# EAGLE design SSD1963-V1.0 (EAGLE 9.6.1)

## Sheet 1 of 2
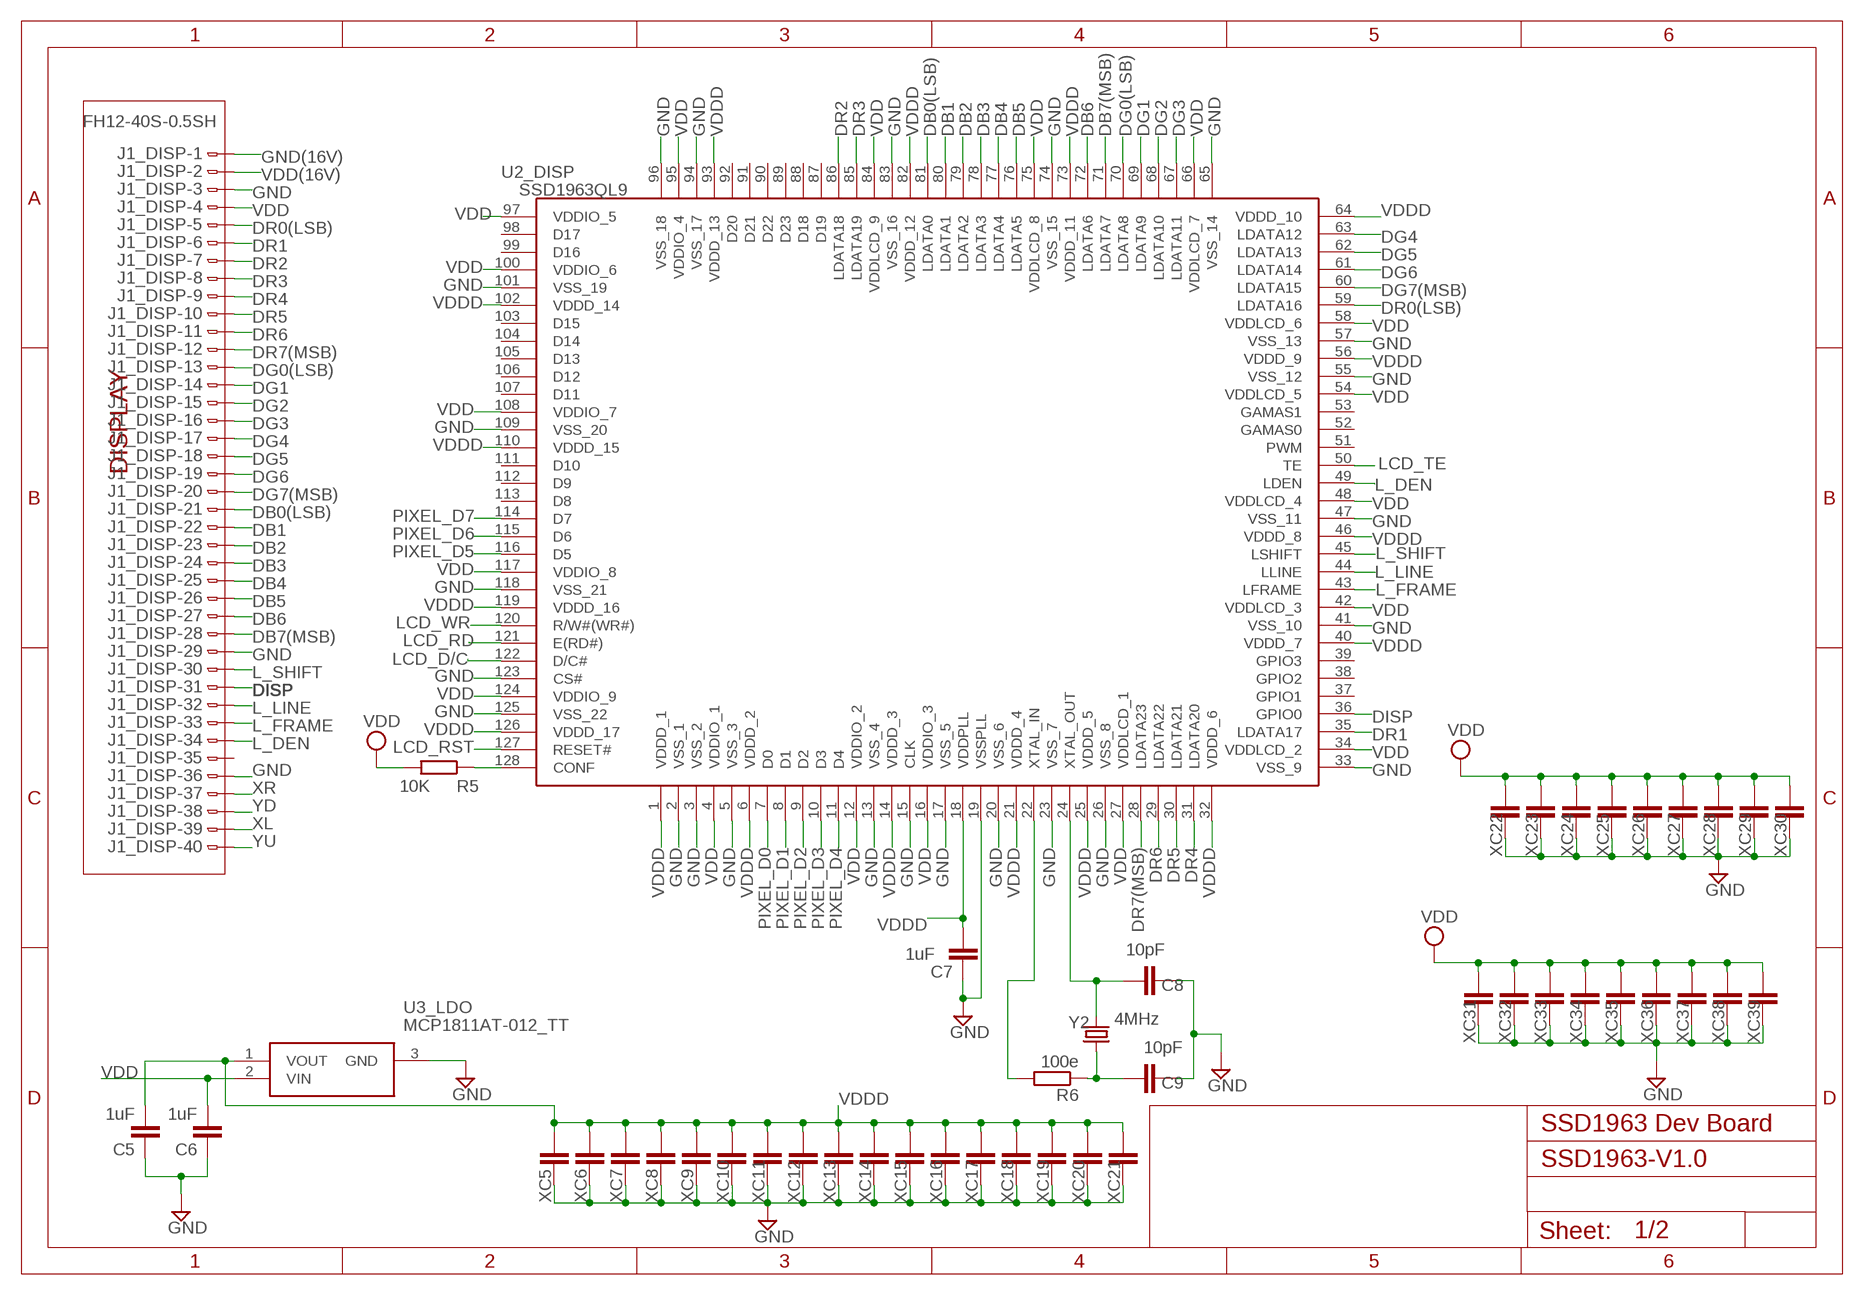
[diagram p0: schematic, sheet 1]

### Parts
C5  1uF  C-EUC1206  [C1206]
C6  1uF  C-EUC1206  [C1206]
C7  1uF  C-EUC0805  [C0805]
C8  10pF  C-EUC1206  [C1206]
C9  10pF  C-EUC1206  [C1206]
J1_DISP  FH12-40S-0.5SH  [FH12-40S-0.5SH]
R5  10K  R-EU_R1206  [R1206]
R6  100e  R-EU_R0805  [R0805]
U2_DISP  SSD1963QL9  [QFP40P1600X1600X160-128N]
U3_LDO  MCP1811AT-012_TT  [SOT95P237X112-3N]
XC5  0.1uF  C-EUC0805  [C0805]
XC6  0.1uF  C-EUC0805  [C0805]
XC7  0.1uF  C-EUC0805  [C0805]
XC8  0.1uF  C-EUC0805  [C0805]
XC9  0.1uF  C-EUC0805  [C0805]
XC10  0.1uF  C-EUC0805  [C0805]
XC11  0.1uF  C-EUC0805  [C0805]
XC12  0.1uF  C-EUC0805  [C0805]
XC13  0.1uF  C-EUC0805  [C0805]
XC14  0.1uF  C-EUC0805  [C0805]
XC15  0.1uF  C-EUC0805  [C0805]
XC16  0.1uF  C-EUC0805  [C0805]
XC17  0.1uF  C-EUC0805  [C0805]
XC18  0.1uF  C-EUC0805  [C0805]
XC19  0.1uF  C-EUC0805  [C0805]
XC20  0.1uF  C-EUC0805  [C0805]
XC21  0.1uF  C-EUC0805  [C0805]
XC22  0.1uF  C-EUC0805  [C0805]
XC23  0.1uF  C-EUC0805  [C0805]
XC24  0.1uF  C-EUC0805  [C0805]
XC25  0.1uF  C-EUC0805  [C0805]
XC26  0.1uF  C-EUC0805  [C0805]
XC27  0.1uF  C-EUC0805  [C0805]
XC28  0.1uF  C-EUC0805  [C0805]
XC29  0.1uF  C-EUC0805  [C0805]
XC30  0.1uF  C-EUC0805  [C0805]
XC31  0.1uF  C-EUC0805  [C0805]
XC32  0.1uF  C-EUC0805  [C0805]
XC33  0.1uF  C-EUC0805  [C0805]
XC34  0.1uF  C-EUC0805  [C0805]
XC35  0.1uF  C-EUC0805  [C0805]
XC36  0.1uF  C-EUC0805  [C0805]
XC37  0.1uF  C-EUC0805  [C0805]
XC38  0.1uF  C-EUC0805  [C0805]
XC39  0.1uF  C-EUC0805  [C0805]
Y2  4MHz  CRYSTALHC49UP  [HC49UP]

### Nets
DB0(LSB): J1_DISP.20 U2_DISP.81(LDATA0)
DB1: J1_DISP.19 U2_DISP.80(LDATA1)
DB2: J1_DISP.18 U2_DISP.79(LDATA2)
DB3: J1_DISP.17 U2_DISP.78(LDATA3)
DB4: J1_DISP.16 U2_DISP.77(LDATA4)
DB5: J1_DISP.15 U2_DISP.76(LDATA5)
DB6: J1_DISP.14 U2_DISP.72(LDATA6)
DB7(MSB): J1_DISP.13 U2_DISP.71(LDATA7)
DG0(LSB): J1_DISP.28 U2_DISP.70(LDATA8)
DG1: J1_DISP.27 U2_DISP.69(LDATA9)
DG2: J1_DISP.26 U2_DISP.68(LDATA10)
DG3: J1_DISP.25 U2_DISP.67(LDATA11)
DG4: J1_DISP.24 U2_DISP.63(LDATA12)
DG5: J1_DISP.23 U2_DISP.62(LDATA13)
DG6: J1_DISP.22 U2_DISP.61(LDATA14)
DG7(MSB): J1_DISP.21 U2_DISP.60(LDATA15)
DISP: J1_DISP.10 U2_DISP.36(GPIO0)
DR0(LSB): J1_DISP.36 U2_DISP.59(LDATA16)
DR1: J1_DISP.35 U2_DISP.35(LDATA17)
DR2: J1_DISP.34 U2_DISP.86(LDATA18)
DR3: J1_DISP.33 U2_DISP.85(LDATA19)
DR4: J1_DISP.32 U2_DISP.31(LDATA20)
DR5: J1_DISP.31 U2_DISP.30(LDATA21)
DR6: J1_DISP.30 U2_DISP.29(LDATA22)
DR7(MSB): J1_DISP.29 U2_DISP.28(LDATA23)
GND: C5.1 C6.1 C7.1 C8.1 C9.1 J1_DISP.5 J1_DISP.12 J1_DISP.38 U2_DISP.2(VSS_1) U2_DISP.3(VSS_2) U2_DISP.5(VSS_3) U2_DISP.13(VSS_4) U2_DISP.15(CLK) U2_DISP.17(VSS_5) U2_DISP.19(VSSPLL) U2_DISP.20(VSS_6) U2_DISP.23(VSS_7) U2_DISP.26(VSS_8) U2_DISP.33(VSS_9) U2_DISP.41(VSS_10) U2_DISP.47(VSS_11) U2_DISP.55(VSS_12) U2_DISP.57(VSS_13) U2_DISP.65(VSS_14) U2_DISP.74(VSS_15) U2_DISP.83(VSS_16) U2_DISP.94(VSS_17) U2_DISP.96(VSS_18) U2_DISP.101(VSS_19) U2_DISP.109(VSS_20) U2_DISP.118(VSS_21) U2_DISP.123(CS#) U2_DISP.125(VSS_22) U3_LDO.3(GND) XC5.1 XC6.1 XC7.1 XC8.1 XC9.1 XC10.1 XC11.1 XC12.1 XC13.1 XC14.1 XC15.1 XC16.1 XC17.1 XC18.1 XC19.1 XC20.1 XC21.1 XC22.1 XC23.1 XC24.1 XC25.1 XC26.1 XC27.1 XC28.1 XC29.1 XC30.1 XC31.1 XC32.1 XC33.1 XC34.1 XC35.1 XC36.1 XC37.1 XC38.1 XC39.1 ; also sheet 2
GND(16V): J1_DISP.40 ; also sheet 2
L_DEN: J1_DISP.7 U2_DISP.49(LDEN)
L_FRAME: J1_DISP.8 U2_DISP.43(LFRAME)
L_LINE: J1_DISP.9 U2_DISP.44(LLINE)
L_SHIFT: J1_DISP.11 U2_DISP.45(LSHIFT)
LCD_D/C: U2_DISP.122(D/C#) ; also sheet 2
LCD_RD: U2_DISP.121(E(RD#)) ; also sheet 2
LCD_RST: U2_DISP.127(RESET#) ; also sheet 2
LCD_TE: U2_DISP.50(TE) ; also sheet 2
LCD_WR: U2_DISP.120(R/W#(WR#)) ; also sheet 2
N$4: R5.1 U2_DISP.128(CONF)
N$54: C8.2 U2_DISP.24(XTAL_OUT) Y2.2
N$55: C9.2 R6.1 Y2.1
N$60: R6.2 U2_DISP.22(XTAL_IN)
PIXEL_D0: U2_DISP.7(D0) ; also sheet 2
PIXEL_D1: U2_DISP.8(D1) ; also sheet 2
PIXEL_D2: U2_DISP.9(D2) ; also sheet 2
PIXEL_D3: U2_DISP.10(D3) ; also sheet 2
PIXEL_D4: U2_DISP.11(D4) ; also sheet 2
PIXEL_D5: U2_DISP.116(D5) ; also sheet 2
PIXEL_D6: U2_DISP.115(D6) ; also sheet 2
PIXEL_D7: U2_DISP.114(D7) ; also sheet 2
VDD: C6.2 J1_DISP.37 R5.2 U2_DISP.4(VDDIO_1) U2_DISP.12(VDDIO_2) U2_DISP.16(VDDIO_3) U2_DISP.27(VDDLCD_1) U2_DISP.34(VDDLCD_2) U2_DISP.42(VDDLCD_3) U2_DISP.48(VDDLCD_4) U2_DISP.54(VDDLCD_5) U2_DISP.58(VDDLCD_6) U2_DISP.66(VDDLCD_7) U2_DISP.75(VDDLCD_8) U2_DISP.84(VDDLCD_9) U2_DISP.95(VDDIO_4) U2_DISP.97(VDDIO_5) U2_DISP.100(VDDIO_6) U2_DISP.108(VDDIO_7) U2_DISP.117(VDDIO_8) U2_DISP.124(VDDIO_9) U3_LDO.2(VIN) XC22.2 XC23.2 XC24.2 XC25.2 XC26.2 XC27.2 XC28.2 XC29.2 XC30.2 XC31.2 XC32.2 XC33.2 XC34.2 XC35.2 XC36.2 XC37.2 XC38.2 XC39.2 ; also sheet 2
VDD(16V): J1_DISP.39 ; also sheet 2
VDDD: C5.2 C7.2 U2_DISP.1(VDDD_1) U2_DISP.6(VDDD_2) U2_DISP.14(VDDD_3) U2_DISP.18(VDDPLL) U2_DISP.21(VDDD_4) U2_DISP.25(VDDD_5) U2_DISP.32(VDDD_6) U2_DISP.40(VDDD_7) U2_DISP.46(VDDD_8) U2_DISP.56(VDDD_9) U2_DISP.64(VDDD_10) U2_DISP.73(VDDD_11) U2_DISP.82(VDDD_12) U2_DISP.93(VDDD_13) U2_DISP.102(VDDD_14) U2_DISP.110(VDDD_15) U2_DISP.119(VDDD_16) U2_DISP.126(VDDD_17) U3_LDO.1(VOUT) XC5.2 XC6.2 XC7.2 XC8.2 XC9.2 XC10.2 XC11.2 XC12.2 XC13.2 XC14.2 XC15.2 XC16.2 XC17.2 XC18.2 XC19.2 XC20.2 XC21.2
XL: J1_DISP.2 ; also sheet 2
XR: J1_DISP.4 ; also sheet 2
YD: J1_DISP.3 ; also sheet 2
YU: J1_DISP.1 ; also sheet 2
Unconnected: J1_DISP.6 U2_DISP.37(GPIO1) U2_DISP.38(GPIO2) U2_DISP.39(GPIO3) U2_DISP.51(PWM) U2_DISP.52(GAMAS0) U2_DISP.53(GAMAS1) U2_DISP.87(D19) U2_DISP.88(D18) U2_DISP.89(D23) U2_DISP.90(D22) U2_DISP.91(D21) U2_DISP.92(D20) U2_DISP.98(D17) U2_DISP.99(D16) U2_DISP.103(D15) U2_DISP.104(D14) U2_DISP.105(D13) U2_DISP.106(D12) U2_DISP.107(D11) U2_DISP.111(D10) U2_DISP.112(D9) U2_DISP.113(D8)

### Notes on the sheet
- DISPLAY
- SSD1963 Dev Board

## Sheet 2 of 2
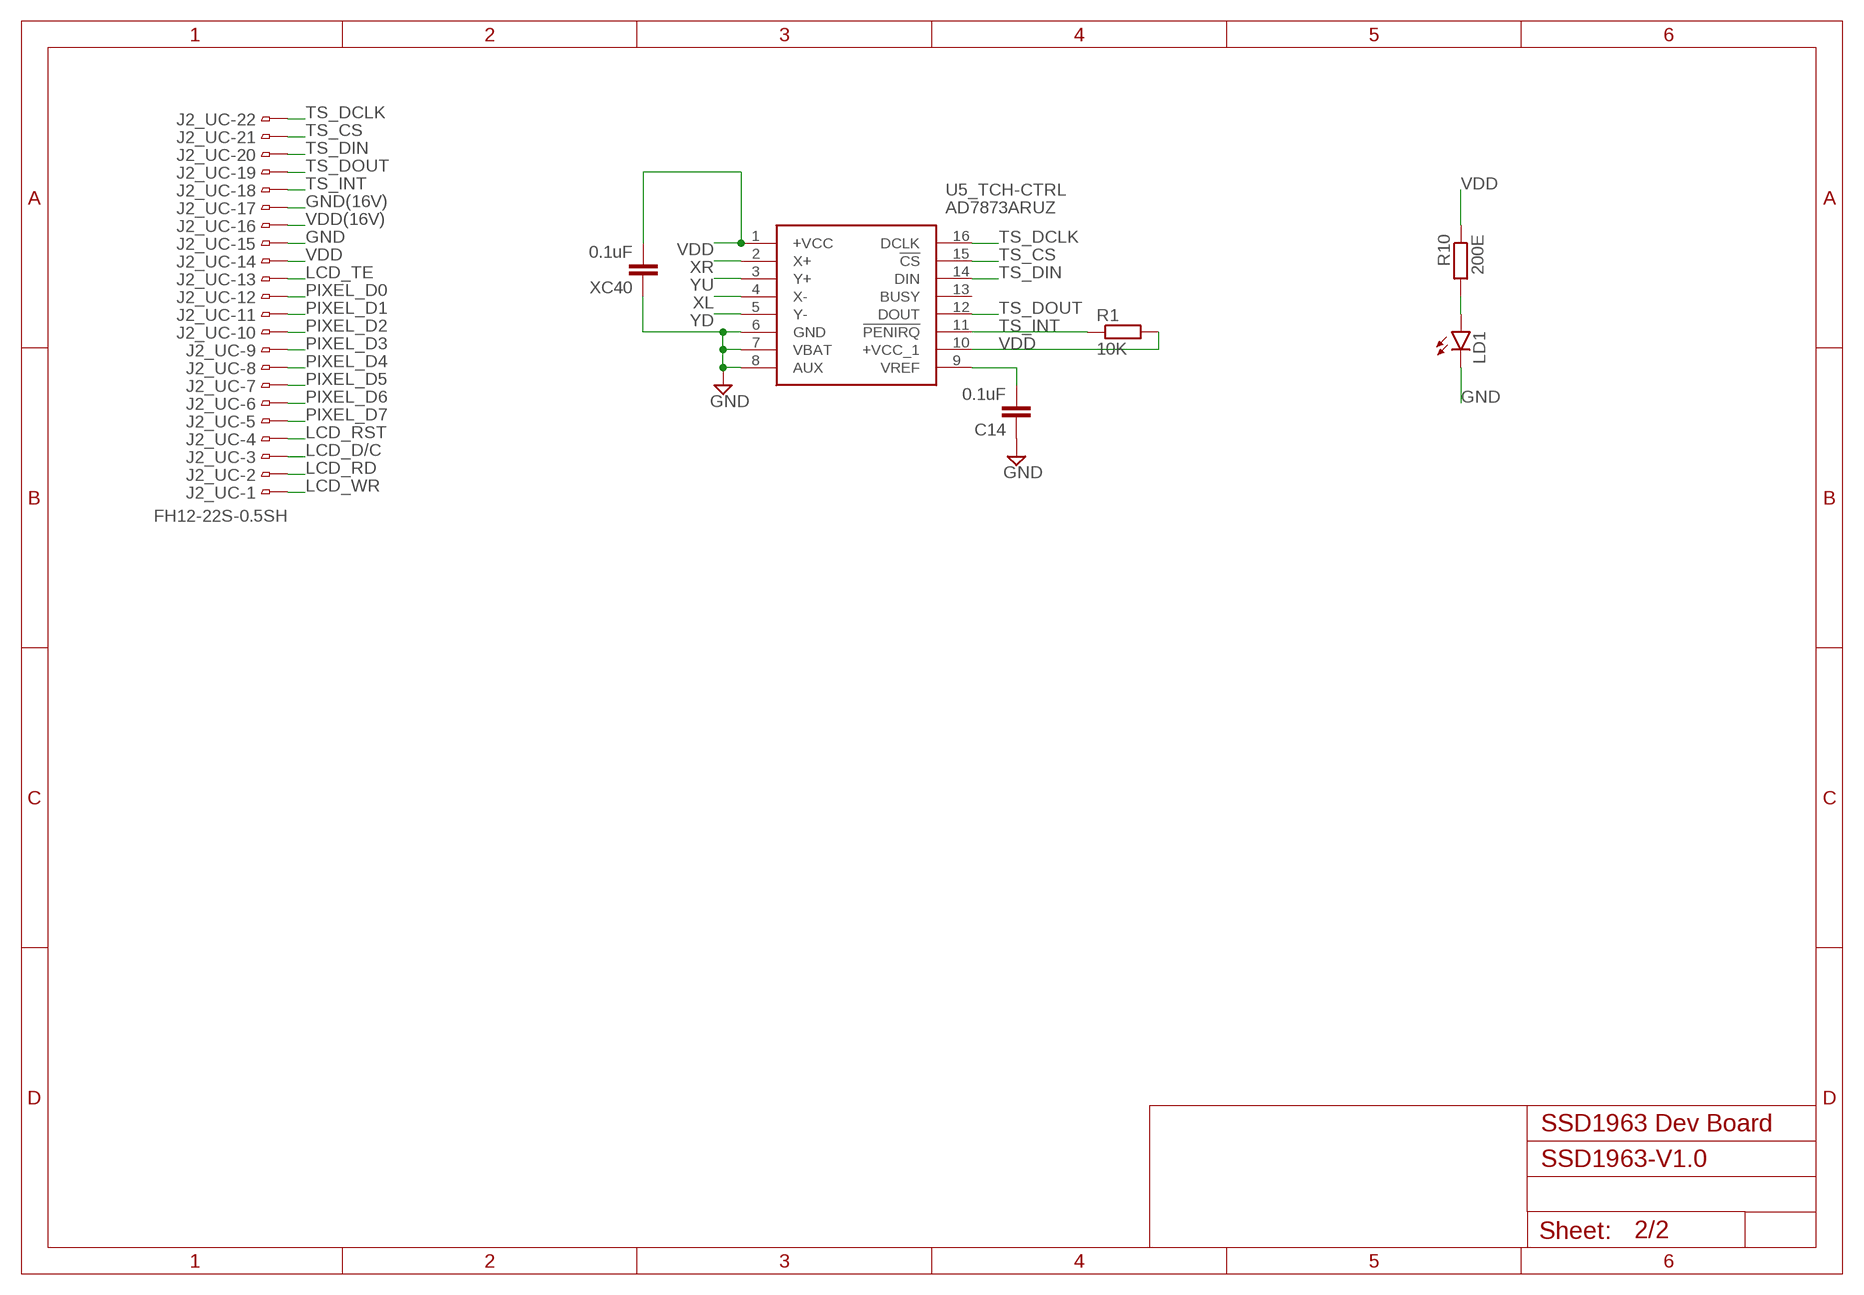
[diagram p1: schematic, sheet 2]

### Parts
C14  0.1uF  C-EUC1206  [C1206]
J2_UC  FH12-22S-0.5SH  [FH12-22S-0.5SH]
LD1  LEDCHIPLED_1206  [CHIPLED_1206]
R1  10K  R-EU_R1206  [R1206]
R10  200E  R-EU_R1206  [R1206]
U5_TCH-CTRL  AD7873ARUZ  [SOP64P600X175-16N]
XC40  0.1uF  C-EUC0805  [C0805]

### Nets
GND: C14.1 J2_UC.15 LD1.C U5_TCH-CTRL.6(GND) U5_TCH-CTRL.7(VBAT) U5_TCH-CTRL.8(AUX) XC40.1 ; also sheet 1
GND(16V): J2_UC.17 ; also sheet 1
LCD_D/C: J2_UC.3 ; also sheet 1
LCD_RD: J2_UC.2 ; also sheet 1
LCD_RST: J2_UC.4 ; also sheet 1
LCD_TE: J2_UC.13 ; also sheet 1
LCD_WR: J2_UC.1 ; also sheet 1
N$9: C14.2 U5_TCH-CTRL.9(VREF)
N$14: LD1.A R10.2
PIXEL_D0: J2_UC.12 ; also sheet 1
PIXEL_D1: J2_UC.11 ; also sheet 1
PIXEL_D2: J2_UC.10 ; also sheet 1
PIXEL_D3: J2_UC.9 ; also sheet 1
PIXEL_D4: J2_UC.8 ; also sheet 1
PIXEL_D5: J2_UC.7 ; also sheet 1
PIXEL_D6: J2_UC.6 ; also sheet 1
PIXEL_D7: J2_UC.5 ; also sheet 1
TS_CS: J2_UC.21 U5_TCH-CTRL.15(!CS)
TS_DCLK: J2_UC.22 U5_TCH-CTRL.16(DCLK)
TS_DIN: J2_UC.20 U5_TCH-CTRL.14(DIN)
TS_DOUT: J2_UC.19 U5_TCH-CTRL.12(DOUT)
TS_INT: J2_UC.18 R1.1 U5_TCH-CTRL.11(!PENIRQ)
VDD: J2_UC.14 R1.2 R10.1 U5_TCH-CTRL.1(+VCC) U5_TCH-CTRL.10(+VCC_1) XC40.2 ; also sheet 1
VDD(16V): J2_UC.16 ; also sheet 1
XL: U5_TCH-CTRL.4(X-) ; also sheet 1
XR: U5_TCH-CTRL.2(X+) ; also sheet 1
YD: U5_TCH-CTRL.5(Y-) ; also sheet 1
YU: U5_TCH-CTRL.3(Y+) ; also sheet 1
Unconnected: U5_TCH-CTRL.13(BUSY)

### Notes on the sheet
- SSD1963 Dev Board

## Library data of the parts
C5-C9 C14 XC5-XC40 = rcl:C-EU: CAPACITOR, European symbol; DESCRIPTION: Capacitor; SPICEPREFIX: C
J1_DISP = ETTCC:FH12-40S-0.5S: 0.5mm Pitch Connectors For FPC/FFC Source: Data sheet <http://www.hirose.co.jp/cataloge_hp/e58605370.pdf>; DESCRIPTION: 0.5mm Pitch Connectors For FPC/FFC; MPN: FH12-40S-0.5SH(55); OC_FARNELL: 1324556; OC_NEWARK: 34M6178
J2_UC = con-hirose:FH12-22S-0.5S: 0.5mm Pitch Connectors For FPC/FFC Source: Data sheet <http://www.hirose.co.jp/cataloge_hp/e58605370.pdf>; OC_FARNELL: 1324551; OC_NEWARK: unknown
LD1 = led:LED: LED OSRAM: - CHIPLED LG R971, LG N971, LY N971, LG Q971, LY Q971, LO R971, LY R971 LH N974, LH R974 LS Q976, LO Q976, LY Q976 LO Q996 - Hyper CHIPLED LW Q18S LB Q993, LB Q99A, LB R99A - SideLED LS A670, LO A670, LY A670, LG A670, LP A670 LB A673, LV A673, LT A673, LW A673 LH A674 LY A675 LS A676, LA A676, LO A676, LY A676, LW A676 LS A679, LY A679, LG A679 - Hyper Micro SIDELED® LS Y876, LA Y876, LO Y876, LY Y876 LT Y87S - SmartLED LW L88C, LW L88S LB L89C, LB L89S, LG L890 LS L89K, LO L89K, LY L89K LS L896, LA L896, LO L896, LY L896 - TOPLED LS T670, LO T670, LY T670, LG T670, LP T670 LSG T670, LSP T670, LSY T670, LOP T670, LYG T670 LG T671, LOG T671, LSG T671 LB T673, LV T673, LT T673, LW T673 LH T674 LS T676, LA T676, LO T676, LY T676, LB T676, LH T676, LSB T676, LW T676 LB T67C, LV T67C, LT T67C, LS T67K, LO T67K, LY T67K, LW E67C LS E67B, LA E67B, LO E67B, LY E67B, LB E67C, LV E67C, LT E67C LW T67C LS T679, LY T679, LG T679 LS T770, LO T770, LY T770, LG T770, LP T770 LB T773, LV T773, LT T773, LW T773 LH T774 LS E675, LA E675, LY E675, LS T675 LS T776, LA T776, LO T776, LY T776, LB T776 LHGB T686 LT T68C, LB T68C - Hyper Mini TOPLED® LB M676 - Mini TOPLED Santana® LG M470 LS M47K, LO M47K, LY M47K Source: http://www.osram.convergy.de LUXEON: - LUMILED® LXK2-PW12-R00, LXK2-PW12-S00, LXK2-PW14-U00, LXK2-PW14-V00 LXK2-PM12-R00, LXK2-PM12-S00, LXK2-PM14-U00 LXK2-PE12-Q00, LXK2-PE12-R00, LXK2-PE12-S00, LXK2-PE14-T00, LXK2-PE14-U00 LXK2-PB12-K00, LXK2-PB12-L00, LXK2-PB12-M00, LXK2-PB14-N00, LXK2-PB14-P00, LXK2-PB14-Q00 LXK2-PR12-L00, LXK2-PR12-M00, LXK2-PR14-Q00, LXK2-PR14-R00 LXK2-PD12-Q00, LXK2-PD12-R00, LXK2-PD12-S00 LXK2-PH12-R00, LXK2-PH12-S00 LXK2-PL12-P00, LXK2-PL12-Q00, LXK2-PL12-R00 Source: www.luxeon.com KINGBRIGHT: KA-3528ASYC Source: www.kingbright.com; DESCRIPTION: SMD Green LED
R1 = rcl:R-EU_: RESISTOR, European symbol; SPICEPREFIX: R
R5 R6 R10 = rcl:R-EU_: RESISTOR, European symbol; DESCRIPTION: Resistor; SPICEPREFIX: R
U2_DISP = ETTCC:SSD1963QL9: 1215KB Embedded Display SRAM LCD Display Controller, LQFP-128 Source: Datasheet <https://www.allshore.com/pdf/solomon_systech_ssd1963.pdf>; DESCRIPTION: 1215KB Embedded Display SRAM LCD Display Controller, LQFP-128
U3_LDO = ETTCC:MCP1811AT-012_TT: LDO Voltage Regulators 1.2V 3-Lead SOT-23 150mA Ultra Low Iq LDO with Auto-Discharge Source: Datasheet <https://datasheet.datasheetarchive.com/originals/dk/DKDS41/DSANUWW0026765.pdf>; DESCRIPTION: LDO Voltage Regulators 1.2V 3-Lead SOT-23 150mA Ultra Low Iq LDO with Auto-Discharge
U5_TCH-CTRL = ETTCC:AD7873ARUZ: AD7873ARQZ, Touch Screen Digitizer, 12bit- 125ksps, 16-Pin QSOP Source: Datasheet <http://www.analog.com/static/imported-files/data_sheets/AD7873.pdf>; DESCRIPTION: AD7873ARUZ, Touch Screen Digitizer, 12bit- 125ksps, 16-Pin QSOP
Y2 = crystal:CRYSTAL: CRYSTAL; DESCRIPTION: Crystal 4MHz; OC_FARNELL: unknown; OC_NEWARK: unknown

## Board
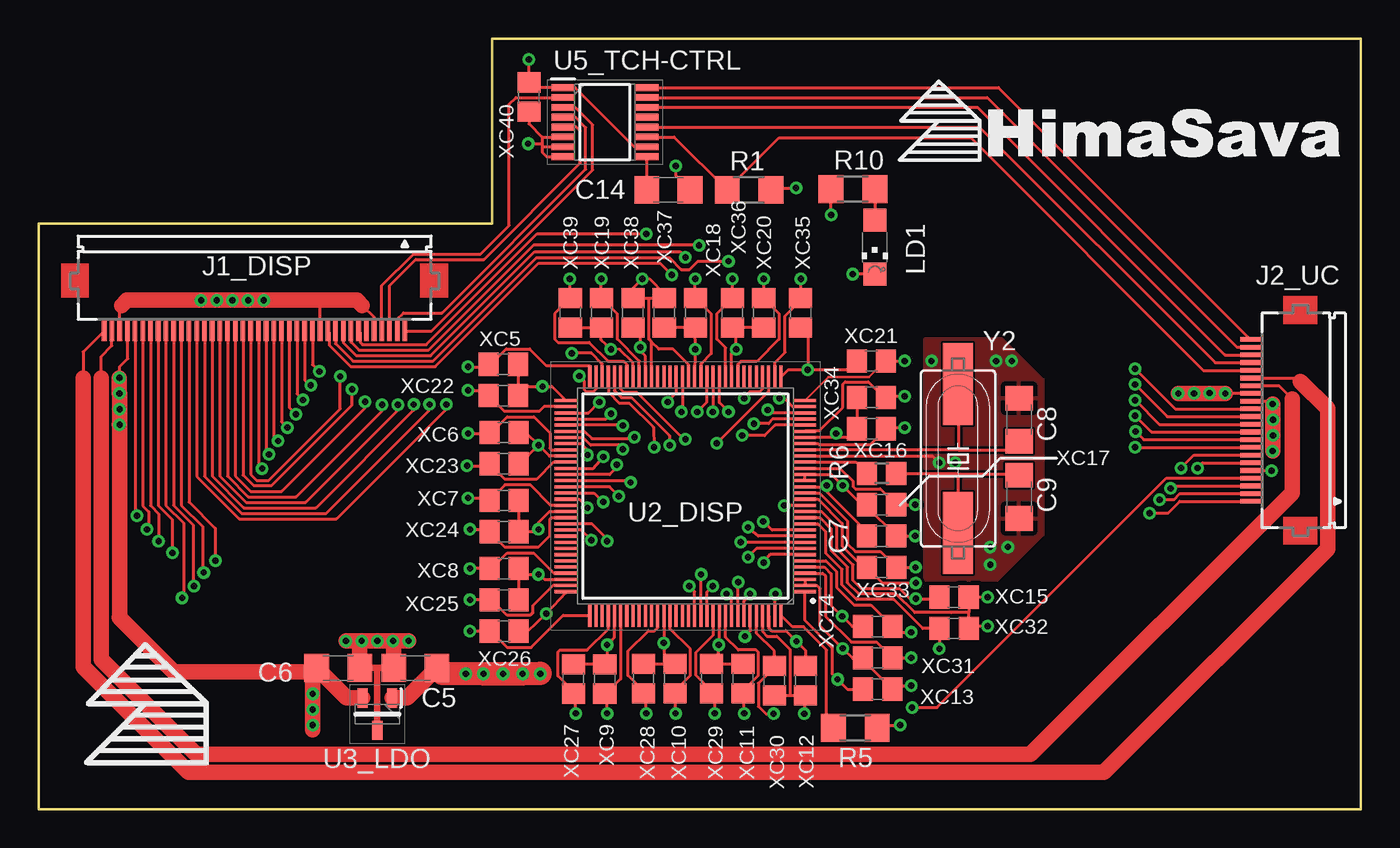
[diagram p2: board, top side]
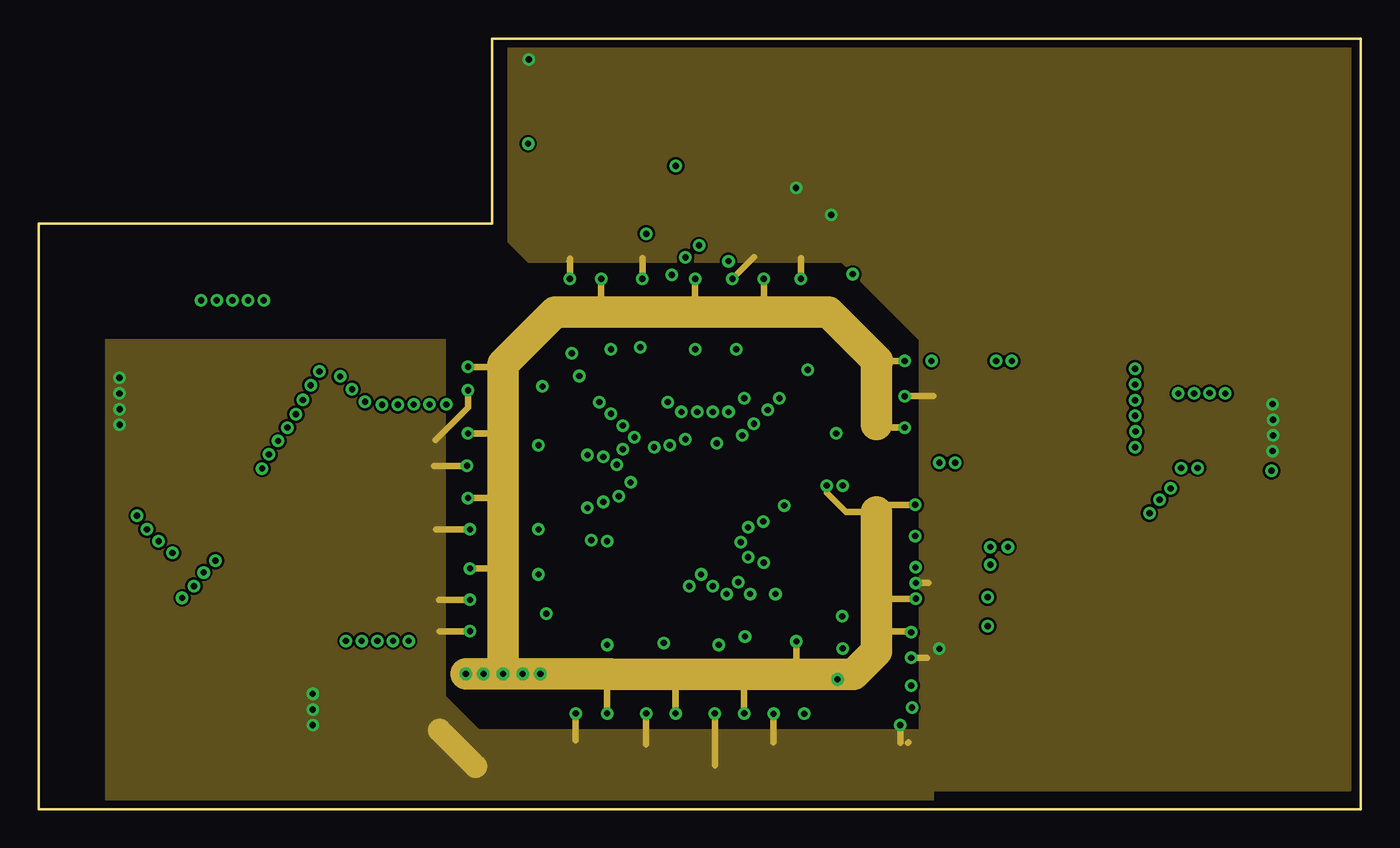
[diagram p3: board, inner layer VCC]
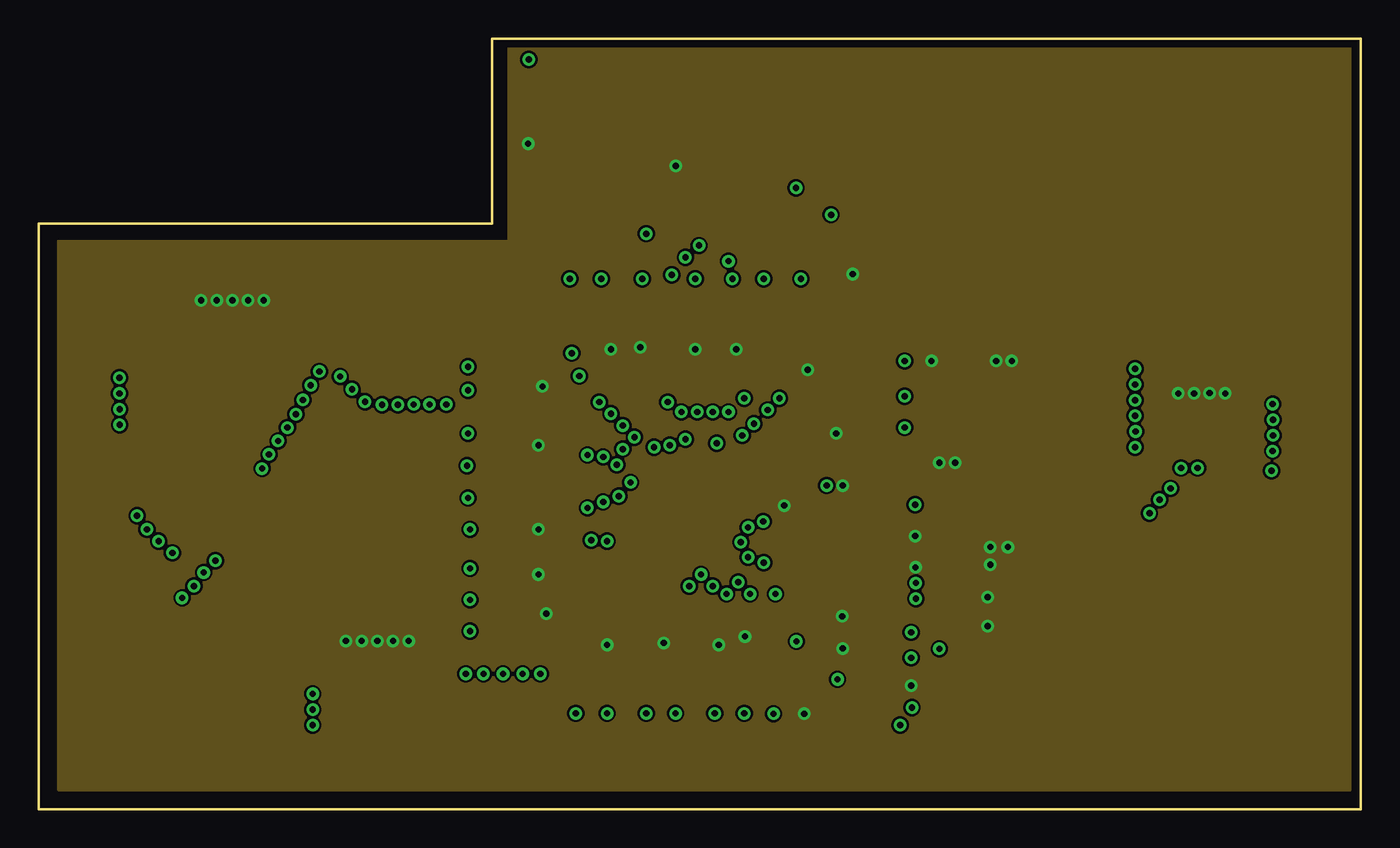
[diagram p4: board, inner layer GND]
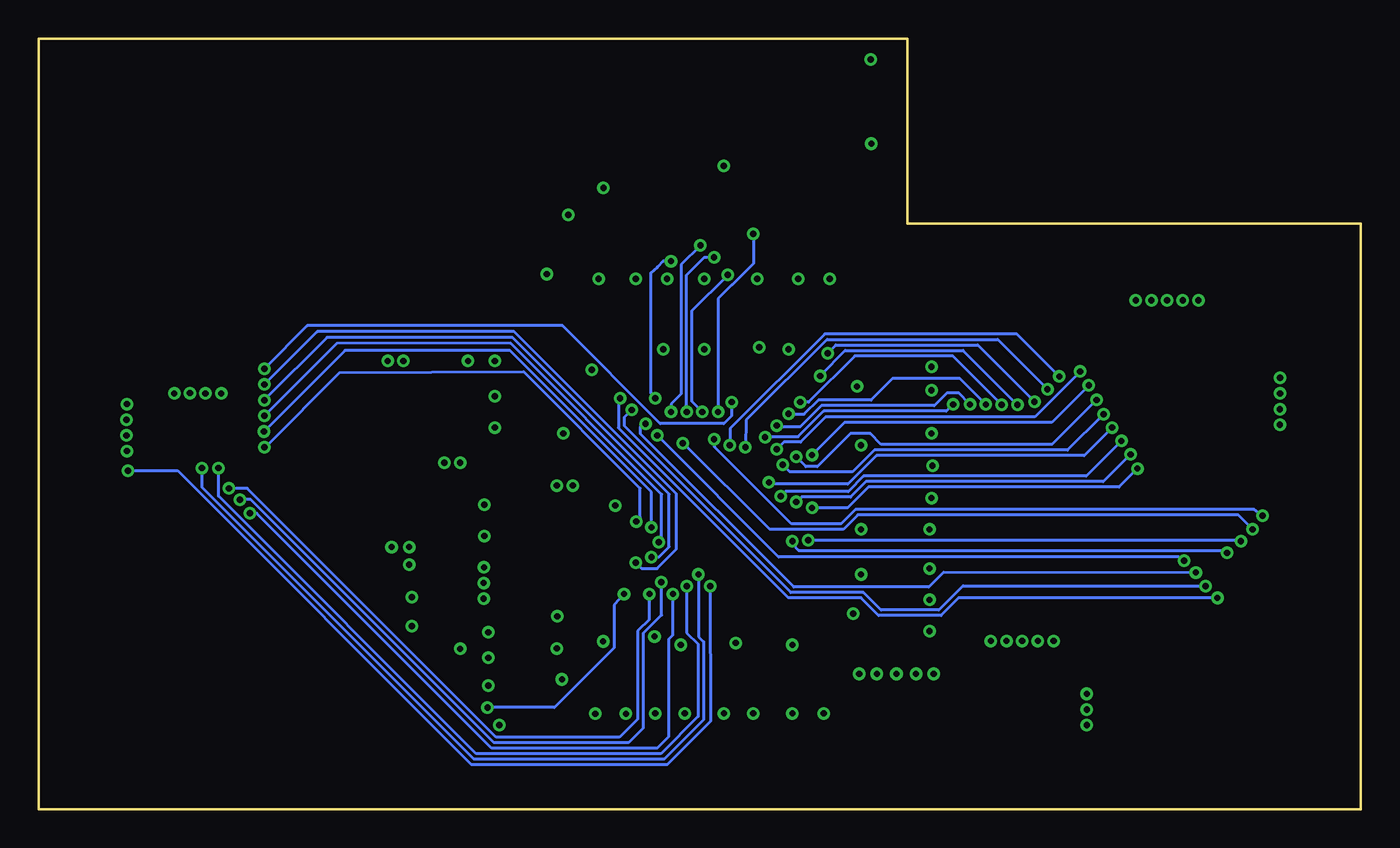
[diagram p5: board, bottom side, seen from below]

Size 85.76 x 50 mm. Coordinates in mm from the lower left corner, seen from the top.
Outline: 0,0 85.76,0 85.76,50 29.42,50 29.42,38 0,38 0,0
Copper layers (1+2*15+16): Top 0.035mm / dielectric 1.5mm / VCC 0.035mm / dielectric 0.15mm / GND 0.035mm / dielectric 0.2mm / Bottom 0.035mm
Design rules "default *": minimum track width 6mil, minimum drill 16mil, track to track 6mil, track to pad 6mil, pad to pad 6mil, via to via 6mil, smd to smd 6mil, copper to edge 20mil, drill to drill 24mil, minimum pad ring 8mil, minimum via ring 8mil, stop-mask expansion 4mil, vias tented up to drill 0mil, thermal gap 12mil

### Footprints (pad centres in the part's own frame; a part is rotated, then mirrored left to right if it is on the bottom)
C1206 = smd 1.6 x 1.8: 1 -1.4,0; 2 1.4,0
C0805 = smd 1.3 x 1.5: 1 -0.95,0; 2 0.95,0
FH12-40S-0.5SH = smd 0.3 x 1.3: 1 -9.75,3.25; 2 -9.25,3.25; 3 -8.75,3.25; 4 -8.25,3.25; 5 -7.75,3.25; 6 -7.25,3.25; 7 -6.75,3.25; 8 -6.25,3.25; 9 -5.75,3.25; 10 -5.25,3.25; 11 -4.75,3.25; 12 -4.25,3.25; 13 -3.75,3.25; 14 -3.25,3.25; 15 -2.75,3.25; 16 -2.25,3.25; 17 -1.75,3.25; 18 -1.25,3.25; 19 -0.75,3.25; 20 -0.25,3.25; 21 0.25,3.25; 22 0.75,3.25; 23 1.25,3.25; 24 1.75,3.25; 25 2.25,3.25; 26 2.75,3.25; 27 3.25,3.25; 28 3.75,3.25; 29 4.25,3.25; 30 4.75,3.25; 31 5.25,3.25; 32 5.75,3.25; 33 6.25,3.25; 34 6.75,3.25; 35 7.25,3.25; 36 7.75,3.25; 37 8.25,3.25; 38 8.75,3.25; 39 9.25,3.25; 40 9.75,3.25
FH12-22S-0.5SH = smd 0.3 x 1.3: 1 -5.25,3.25; 2 -4.75,3.25; 3 -4.25,3.25; 4 -3.75,3.25; 5 -3.25,3.25; 6 -2.75,3.25; 7 -2.25,3.25; 8 -1.75,3.25; 9 -1.25,3.25; 10 -0.75,3.25; 11 -0.25,3.25; 12 0.25,3.25; 13 0.75,3.25; 14 1.25,3.25; 15 1.75,3.25; 16 2.25,3.25; 17 2.75,3.25; 18 3.25,3.25; 19 3.75,3.25; 20 4.25,3.25; 21 4.75,3.25; 22 5.25,3.25
CHIPLED_1206 = smd 1.5 x 1.5: A 0,-1.75; C 0,1.75
R1206 = smd 1.6 x 1.803: 1 -1.422,0; 2 1.422,0
R0805 = smd 1.3 x 1.5: 1 -0.95,0; 2 0.95,0
QFP40P1600X1600X160-128N = smd 1.475 x 0.2: 1 -7.738,6.2; 2 -7.738,5.8; 3 -7.738,5.4; 4 -7.738,5; 5 -7.738,4.6; 6 -7.738,4.2; 7 -7.738,3.8; 8 -7.738,3.4; 9 -7.738,3; 10 -7.738,2.6; 11 -7.738,2.2; 12 -7.738,1.8; 13 -7.738,1.4; 14 -7.738,1; 15 -7.738,0.6; 16 -7.738,0.2; 17 -7.738,-0.2; 18 -7.738,-0.6; 19 -7.738,-1; 20 -7.738,-1.4; 21 -7.738,-1.8; 22 -7.738,-2.2; 23 -7.738,-2.6; 24 -7.738,-3; 25 -7.738,-3.4; 26 -7.738,-3.8; 27 -7.738,-4.2; 28 -7.738,-4.6; 29 -7.738,-5; 30 -7.738,-5.4; 31 -7.738,-5.8; 32 -7.738,-6.2; 65 7.738,-6.2; 66 7.738,-5.8; 67 7.738,-5.4; 68 7.738,-5; 69 7.738,-4.6; 70 7.738,-4.2; 71 7.738,-3.8; 72 7.738,-3.4; 73 7.738,-3; 74 7.738,-2.6; 75 7.738,-2.2; 76 7.738,-1.8; 77 7.738,-1.4; 78 7.738,-1; 79 7.738,-0.6; 80 7.738,-0.2; 81 7.738,0.2; 82 7.738,0.6; 83 7.738,1; 84 7.738,1.4; 85 7.738,1.8; 86 7.738,2.2; 87 7.738,2.6; 88 7.738,3; 89 7.738,3.4; 90 7.738,3.8; 91 7.738,4.2; 92 7.738,4.6; 93 7.738,5; 94 7.738,5.4; 95 7.738,5.8; 96 7.738,6.2 | smd 0.2 x 1.475: 33 -6.2,-7.738; 34 -5.8,-7.738; 35 -5.4,-7.738; 36 -5,-7.738; 37 -4.6,-7.738; 38 -4.2,-7.738; 39 -3.8,-7.738; 40 -3.4,-7.738; 41 -3,-7.738; 42 -2.6,-7.738; 43 -2.2,-7.738; 44 -1.8,-7.738; 45 -1.4,-7.738; 46 -1,-7.738; 47 -0.6,-7.738; 48 -0.2,-7.738; 49 0.2,-7.738; 50 0.6,-7.738; 51 1,-7.738; 52 1.4,-7.738; 53 1.8,-7.738; 54 2.2,-7.738; 55 2.6,-7.738; 56 3,-7.738; 57 3.4,-7.738; 58 3.8,-7.738; 59 4.2,-7.738; 60 4.6,-7.738; 61 5,-7.738; 62 5.4,-7.738; 63 5.8,-7.738; 64 6.2,-7.738; 97 6.2,7.738; 98 5.8,7.738; 99 5.4,7.738; 100 5,7.738; 101 4.6,7.738; 102 4.2,7.738; 103 3.8,7.738; 104 3.4,7.738; 105 3,7.738; 106 2.6,7.738; 107 2.2,7.738; 108 1.8,7.738; 109 1.4,7.738; 110 1,7.738; 111 0.6,7.738; 112 0.2,7.738; 113 -0.2,7.738; 114 -0.6,7.738; 115 -1,7.738; 116 -1.4,7.738; 117 -1.8,7.738; 118 -2.2,7.738; 119 -2.6,7.738; 120 -3,7.738; 121 -3.4,7.738; 122 -3.8,7.738; 123 -4.2,7.738; 124 -4.6,7.738; 125 -5,7.738; 126 -5.4,7.738; 127 -5.8,7.738; 128 -6.2,7.738
SOT95P237X112-3N = smd 1.25 x 0.65: 1 -1.05,0.95; 2 -1.05,-0.95; 3 1.05,0
SOP64P600X175-16N = smd 1.52 x 0.44: 1 -2.715,2.24; 2 -2.715,1.6; 3 -2.715,0.96; 4 -2.715,0.32; 5 -2.715,-0.32; 6 -2.715,-0.96; 7 -2.715,-1.6; 8 -2.715,-2.24; 9 2.715,-2.24; 10 2.715,-1.6; 11 2.715,-0.96; 12 2.715,-0.32; 13 2.715,0.32; 14 2.715,0.96; 15 2.715,1.6; 16 2.715,2.24
HC49UP = smd 5.334 x 1.93: 1 -4.826,0; 2 4.826,0

### Placement (x,y rotation side)
C5  24.44,9.17 0 top
C6  19.43,9.17 180 top
C7  54.67,17.73 180 top
C8  63.59,25.27 270 top
C9  63.59,20.27 90 top
C14  40.84,40.18 180 top
J1_DISP  14.01,34.29 180 top
J2_UC  81.84,25.23 90 top
LD1  54.23,36.46 180 top
R1  46.08,40.18 0 top
R5  52.97,5.28 0 top
R6  54.67,21.79 180 top
R10  52.82,40.23 0 top
U2_DISP  41.95,20.32 180 top
U3_LDO  21.97,6.17 270 top
U5_TCH-CTRL  36.73,44.58 0 top
XC5  30.14,28.87 180 top
XC6  30.19,24.45 180 top
XC7  30.19,20.04 180 top
XC8  30.19,15.62 180 top
XC9  36.72,8.46 270 top
XC10  41.26,8.48 270 top
XC11  45.68,8.48 270 top
XC12  49.75,8.36 90 top
XC13  54.42,7.8 180 top
XC14  54.42,11.86 0 top
XC15  59.37,13.77 180 top
XC16  54.02,24.69 0 top
XC17  54.67,19.76 0 top
XC18  42.61,32.21 90 top
XC19  36.51,32.21 90 top
XC20  47.03,32.21 90 top
XC21  54.02,29.08 0 top
XC22  30.14,26.84 180 top
XC23  30.19,22.42 180 top
XC24  30.19,18.01 180 top
XC25  30.19,13.59 180 top
XC26  30.19,11.56 180 top
XC27  34.69,8.46 270 top
XC28  39.23,8.48 270 top
XC29  43.65,8.48 270 top
XC30  47.72,8.36 90 top
XC31  54.42,9.83 0 top
XC32  59.38,11.73 180 top
XC33  54.68,15.7 180 top
XC34  54.02,26.72 0 top
XC35  49.42,32.21 90 top
XC36  45,32.21 90 top
XC37  40.58,32.21 90 top
XC38  38.55,32.21 90 top
XC39  34.48,32.21 90 top
XC40  31.8,46.2 90 top
Y2  59.63,22.76 90 top

### Tracks (layer width: path | path; a pad name or v marks a point on that pad's centre or on a via)
DB0(LSB)  (via drill 0.41)
  Top 0.203: J1_DISP.20 14.26,22.34 v14.5,22.11 | U2_DISP.81 35.04,20.12 v35.6,19.56
  Bottom 0.203: v14.5,22.11 15.7,20.9 31.96,20.9 33.3,19.56 v35.6,19.56
DB1  (via drill 0.41)
  Top 0.203: U2_DISP.80 36.02,20.52 v36.62,19.94 | J1_DISP.19 14.76,23.21 v14.95,23.02
  Bottom 0.203: v36.62,19.94 36.27,20.26 33.1,20.26 32.1,21.26 16.71,21.26 v14.95,23.02
DB2  (via drill 0.41)
  Top 0.203: J1_DISP.18 15.26,24.2 15.53,23.92 v15.53,23.9 | v37.63,20.32 37.03,20.92 U2_DISP.79
  Bottom 0.203: v15.53,23.9 17.81,21.61 32.25,21.61 33.25,20.61 37.34,20.61 v37.63,20.32
DB3  (via drill 0.41)
  Top 0.203: U2_DISP.78 38.29,21.32 v38.39,21.21 | J1_DISP.17 15.76,25.14 v16.14,24.76
  Bottom 0.203: v16.14,24.76 17.95,22.95 31.42,22.95 33.27,21.1 38.32,21.1 v38.39,21.21
DB4  (via drill 0.41)
  Top 0.203: v37.5,22.35 37.5,22.17 37.05,21.72 U2_DISP.77 | J1_DISP.16 16.26,26.06 v16.69,25.63
  Bottom 0.203: v16.69,25.63 16.71,25.63 19.03,23.3 31.57,23.3 32.99,21.89 37.04,21.89 v37.5,22.35
DB5  (via drill 0.41)
  Top 0.203: U2_DISP.76 35.97,22.12 v36.62,22.86 | J1_DISP.15 16.76,26.94 v17.15,26.56
  Bottom 0.203: v17.15,26.56 20.03,23.67 31.12,23.67 31.82,24.37 33.12,24.37 35.25,22.24 36,22.24 v36.62,22.86
DB6  (via drill 0.41)
  Top 0.203: U2_DISP.72 35.2,23.72 35.6,23.32 v35.6,22.99 | J1_DISP.14 17.26,27.86 17.62,27.5 v17.65,27.5
  Bottom 0.203: v17.65,27.5 20.06,25.1 33.49,25.1 v35.6,22.99
DB7(MSB)  (via drill 0.41)
  Top 0.203: U2_DISP.71 35.3,24.12 35.8,23.62 37.63,23.62 v37.89,23.37 | J1_DISP.13 17.76,28.85 v18.21,28.41
  Bottom 0.203: v18.21,28.41 21.16,25.45 34.72,25.45 36.35,23.82 37.43,23.82 v37.89,23.37
DG0(LSB)  (via drill 0.41)
  Top 0.203: U2_DISP.70 35.4,24.52 35.88,24.04 38.57,24.04 v38.65,24.13 | J1_DISP.28 10.26,21.6 13.02,18.85 19.32,18.85 26.45,25.98 v26.45,26.27
  Bottom 0.203: v26.45,26.27 26.89,25.83 34.84,25.83 36.5,24.18 38.6,24.18 v38.65,24.13
DG1  (via drill 0.41)
  Top 0.203: v37.89,24.89 37.86,24.92 U2_DISP.69 | J1_DISP.27 10.76,21.61 13.16,19.2 18.66,19.2 25.36,25.89 v25.36,26.26
  Bottom 0.203: v25.36,26.26 26.12,27.03 26.83,27.03 27.67,26.19 34.99,26.19 36.34,24.83 37.83,24.83 v37.89,24.89
DG2  (via drill 0.41)
  Top 0.203: J1_DISP.26 11.26,21.61 13.31,19.56 17.99,19.56 24.33,25.89 v24.33,26.26 | v37.12,25.65 36.79,25.32 U2_DISP.68
  Bottom 0.203: v24.33,26.26 26.03,27.96 30.34,27.96 31.77,26.54 35.2,26.54 36.11,25.63 37.1,25.63 v37.12,25.65
DG3  (via drill 0.41)
  Top 0.203: U2_DISP.67 35.67,25.72 v36.36,26.42 | J1_DISP.25 11.76,21.61 13.46,19.91 17.32,19.91 23.31,25.9 v23.31,26.25
  Bottom 0.203: v23.31,26.25 26.47,29.41 32.83,29.41 35.83,26.42 v36.36,26.42
DG4  (via drill 0.41)
  Top 0.203: J1_DISP.24 12.26,21.61 13.61,20.27 16.7,20.27 22.28,25.85 v22.28,26.24 | v35.07,28.11 35.4,27.78 35.4,27.21 35.55,27.07 35.95,27.07 36.16,27.27 U2_DISP.63
  Bottom 0.203: v22.28,26.24 25.81,29.77 33.45,29.77 35.07,28.15 v35.07,28.11
DG5  (via drill 0.41)
  Top 0.203: J1_DISP.23 12.76,21.63 13.76,20.63 15.77,20.63 21.17,26.04 v21.17,26.44 | U2_DISP.62 36.55,28.89 35.85,29.59 v34.58,29.59
  Bottom 0.203: v21.17,26.44 24.86,30.12 34.05,30.12 v34.58,29.59
DG6  (via drill 0.41)
  Top 0.203: J1_DISP.22 13.26,21.68 13.95,20.99 15.1,20.99 20.34,26.23 v20.34,27.25 | U2_DISP.61 36.95,27.05 37.65,26.36 38.3,26.36 39.87,24.79 v39.92,23.5
  Bottom 0.203: v20.34,27.25 23.56,30.48 34.63,30.48 39.87,25.24 v39.92,23.5
DG7(MSB)  (via drill 0.41)
  Top 0.203: J1_DISP.21 13.76,21.73 14.14,21.35 14.92,21.35 19.56,25.98 v19.56,28.08 | U2_DISP.60 37.35,27.16 37.8,26.71 38.44,26.71 40.91,24.25 v40.93,23.62
  Bottom 0.203: v19.56,28.08 22.32,30.84 34.78,30.84 40.91,24.7 v40.93,23.62
DISP  (via drill 0.41)
  Top 0.203: U2_DISP.36 46.95,27.27 46.75,27.07 46.12,27.07 v45.76,26.67 | J1_DISP.10 19.26,30.21 20.4,29.07 25.58,29.07 32.28,35.78 40.93,35.78 41.68,35.03 42.22,35.03 42.76,35.56 v44.74,35.56
  Bottom 0.203: v45.76,26.67 46.06,27.02 46.06,34.8 45.63,35.18 45.25,35.56 v44.74,35.56
DR0(LSB)  (via drill 0.41)
  Top 0.203: v41.95,24 41.86,23.99 38.79,27.07 37.94,27.07 37.75,27.26 U2_DISP.59 | J1_DISP.36 6.26,19.18 v6.39,19.05
  Bottom 0.203: v6.39,19.05 6.93,19.46 32.77,19.46 33.71,18.52 36.93,18.52 41.92,23.51 v41.95,24
DR1  (via drill 0.41)
  Top 0.203: U2_DISP.35 47.35,27.1 44.07,23.82 v43.98,23.75 | J1_DISP.35 6.76,19.68 7.15,19.29 7.15,18.29 v7.02,18.16
  Bottom 0.203: v43.98,23.75 38.34,18.16 33.56,18.16 32.63,19.1 7.96,19.1 v7.02,18.16
DR2  (via drill 0.41)
  Top 0.203: v7.79,17.4 7.79,19.18 7.26,19.7 J1_DISP.34 | v35.85,17.46 35.2,18.12 U2_DISP.86
  Bottom 0.203: v35.85,17.46 7.85,17.46 v7.79,17.4
DR3  (via drill 0.41)
  Top 0.203: U2_DISP.85 35.89,18.52 36.87,17.54 v36.87,17.4 | v8.68,16.64 8.68,18.8 7.76,19.71 J1_DISP.33
  Bottom 0.203: v8.68,16.64 8.84,16.8 36.46,16.8 36.87,17.21 v36.87,17.4
DR4  (via drill 0.41)
  Top 0.203: U2_DISP.31 48.9,26.11 48.36,26.65 v48.05,26.67 | v9.31,13.72 9.41,13.82 9.41,18.57 8.26,19.72 J1_DISP.32
  Bottom 0.203: v9.31,13.72 26.09,13.72 27.24,12.57 31.28,12.57 32.42,13.72 37.13,13.72 48.16,24.75 48.16,26.51 v48.05,26.67
DR5  (via drill 0.41)
  Top 0.203: U2_DISP.30 47.47,25.72 v47.28,25.91 | v10.07,14.48 10.02,14.53 10.02,18.46 8.76,19.72 J1_DISP.31
  Bottom 0.203: v10.07,14.48 v10.08,14.48 25.81,14.5 27.38,12.93 31.13,12.93 32.27,14.07 36.97,14.07 47.79,24.89 47.79,25.4 v47.28,25.91
DR6  (via drill 0.41)
  Top 0.203: U2_DISP.29 47.59,25.32 47.34,25.02 v46.39,25.02 | v10.71,15.37 10.63,15.44 10.63,18.35 9.26,19.73 J1_DISP.30
  Bottom 0.203: v10.71,15.37 27.06,15.4 28.03,14.43 36.77,14.43 46.74,24.39 46.74,24.79 v46.39,25.02
DR7(MSB)  (via drill 0.41)
  Top 0.203: U2_DISP.28 47.77,24.92 47.09,24.24 v45.63,24.26 | J1_DISP.29 9.76,19.94 11.47,18.23 v11.47,16.13
  Bottom 0.203: v11.47,16.13 11.82,16.37 37.77,16.37 v45.63,24.26
GND  (via drill 0.41)
  Top 0.203: U2_DISP.94 32.82,14.92 32.5,15.24 v32.42,15.24 31.52,15.24 XC8.1 XC25.1 | U2_DISP.83 33.14,19.32 32.42,18.61 v32.42,18.16 32.27,18.01 XC24.1 XC7.1 | XC5.1 XC22.1 31.69,27.43 v32.68,27.43 33.3,27.43 U2_DISP.65 | U2_DISP.96 34.21,14.07 v32.93,12.7 31.7,11.56 XC26.1 | XC27.1 XC9.1 36.87,9.56 v36.87,10.67 37.35,11.15 U2_DISP.101 | XC28.1 40.53,9.43 | 40.53,9.43 XC10.1 | 40.53,9.43 40.55,9.46 v40.55,10.79 U2_DISP.109 | XC11.1 XC29.1 44.11,9.89 v44.11,10.67 44.15,10.71 U2_DISP.118 | XC34.1 XC16.1 52.5,24.12 51.71,24.12 | 51.71,24.12 U2_DISP.26 | XC20.1 45.12,31.26 | 45.12,31.26 XC36.1 | XC37.1 XC18.1 42.55,31.2 v42.58,29.85 U2_DISP.47 | U2_DISP.57 38.55,28.97 37.68,29.83 v37.12,29.85 36.49,30.45 36.49,31.26 | XC39.1 36.49,31.26 | 36.49,31.26 XC19.1 | U2_DISP.41 44.95,29.58 v45.25,29.85 45.21,31.17 45.12,31.26 | J1_DISP.38 5.26,32.55 5.4,32.69 | 20.99,32.69 21.76,31.93 J1_DISP.5 | 22.99,9.17 21.95,9.17 21.11,9.17 C6.1 | U2_DISP.74 33.13,22.92 v32.42,23.62 | U2_DISP.55 39.35,29.4 39.03,29.72 v39.03,29.97 39.03,30.78 XC38.1 | XC21.1 52.49,28.51 v49.89,28.51 | v49.89,28.51 48.6,28.51 U2_DISP.33 | XC35.1 49.89,30.79 v49.89,28.51 | XC6.1 31.6,24.45 v32.42,23.62 | XC23.1 31.22,22.42 v32.42,23.62 | J1_DISP.12 18.26,32.99 18.29,33.02 | v51.73,24.38 51.73,24.14 51.71,24.12 | U2_DISP.23 57.98,22.92 v58.42,22.48 | U2_DISP.15 v48.37,19.72 v48.36,19.71 | U2_DISP.19 U2_DISP.20 51.43,21.72 v52.15,21.01 53.39,19.76 XC17.1 53.72,19.63 C7.1 v56.84,17.73 | U2_DISP.17 50.64,20.52 52.46,18.7 52.46,17.23 52.97,16.72 54.6,16.72 XC33.1 v56.87,15.7 | U2_DISP.13 50.68,18.92 51.39,18.2 51.39,16.79 52.47,15.72 52.47,14.69 53.19,13.97 55.61,13.97 56.82,12.76 59.17,12.76 59.19,12.78 60.32,12.78
  Top 0.203: 60.32,12.78 XC32.1 60.48,11.89 v61.54,11.89 | 60.32,12.78 XC15.1 v61.54,13.77 | U2_DISP.5 50.95,15.72 51.4,15.28 51.4,13.24 v52.12,12.52 52.78,11.86 XC14.1 | U2_DISP.3 U2_DISP.2 50.48,14.52 50.69,14.32 50.69,11.9 v52.15,10.44 52.81,9.78 53.47,9.78 | 53.47,9.78 53.47,9.7 XC13.1 55.6,8.03 v56.59,8.03 | 53.47,9.78 XC31.1 | U2_DISP.123 46.15,11.55 v45.81,11.22 | U2_DISP.125 46.95,11.53 47.26,11.23 47.87,11.23 48.72,10.38 48.72,7.44 48.68,7.41 | XC30.1 48.68,7.41 | 48.68,7.41 XC12.1 49.66,7.32 v49.66,6.2 | 54.44,34.42 LD1.C v52.81,34.71 v52.81,34.72 | XC40.1 31.8,44.47 32.66,43.61 | 32.66,43.61 U5_TCH-CTRL.6 | 32.66,43.61 32.66,43.18 | 32.66,43.18 32.66,42.93 | 32.66,42.93 32.66,42.62 32.95,42.34 U5_TCH-CTRL.8 | 32.66,42.93 32.72,42.98 U5_TCH-CTRL.7 | J2_UC.15 v76.97,26.98 v76.96,26.97 | v31.75,43.18 32.66,43.18 | C14.1 41.33,41.1 v41.33,41.73
  Top 0.406: U3_LDO.3 21.95,5.15 21.95,9.17 | C5.1 22.99,9.17 21.11,9.17
  Top 1.016: v19.94,10.92 20.83,10.92 | 20.83,10.92 23.04,10.92 | 23.04,10.92 v24,10.92 | C5.1 23.04,10.92 | C6.1 20.83,10.92 | 20.99,32.69 20.66,33.02 18.29,33.02 v14.6,33.02 v13.59,33.02 v12.57,33.02 v11.56,33.02 v10.54,33.02 5.73,33.02 5.4,32.69 | v76.96,26.97 v73.91,26.97
  other vias: 61.72,17.02 62.1,29.08 57.91,29.08 62.86,17.02 61.72,15.87 63.12,29.08 21.97,10.92 22.99,10.92 20.95,10.92 59.44,22.48 75.95,27 74.93,26.97
  pour Top: 57.44,14.88 62.22,14.88 65.17,17.83 65.17,27.85 62.51,30.51 57.44,30.51
  pour GND: 83.94,56.02 67.44,56.02 67.44,60.02
  pour GND: 1.27,1.27 85.09,1.27 85.09,49.53 30.48,49.53 30.48,36.83 1.27,36.83
GND(16V)
  Top 0.203: 2.88,27.99 2.88,29.67 J1_DISP.40 | J2_UC.17 81.62,27.98 81.84,27.76
  Top 1.016: 2.88,27.99 2.88,9.25 9.75,2.39 69.08,2.39 83.6,16.91 83.6,26 81.84,27.76
L_DEN  (via drill 0.41)
  Top 0.203: J1_DISP.7 20.86,30.94 20.86,30.29 21,30.14 25.13,30.14 32.34,37.34 v39.41,37.34 | U2_DISP.49 41.75,25.83 v41.7,25.78
  Bottom 0.203: v39.41,37.34 39.41,35.39 40.79,34.01 40.81,34.01 41.7,33.12 v41.7,25.78
L_FRAME  (via drill 0.41)
  Top 0.203: J1_DISP.8 20.26,30.3 20.78,29.78 25.28,29.78 32.13,36.63 42.79,36.63 v42.84,36.58 | v44.74,25.78 44.15,26.37 U2_DISP.43
  Bottom 0.203: v44.74,25.78 44.74,26.29 44.08,26.95 44.08,35.33 v42.84,36.58
L_LINE  (via drill 0.41)
  Top 0.203: U2_DISP.44 43.75,25.8 v43.73,25.78 | J1_DISP.9 19.76,30.27 20.6,29.43 25.43,29.43 32.17,36.17 41.63,36.17 41.95,35.85 v41.95,35.81
  Bottom 0.203: v43.73,25.78 43.73,34.67 42.58,35.81 v41.95,35.81
L_SHIFT  (via drill 0.41)
  Top 0.203: J1_DISP.11 18.86,30.94 18.86,30.11 20.25,28.71 25.72,28.71 32.43,35.42 40.32,35.42 v41.06,34.67 | v42.71,25.78 43.35,26.42 U2_DISP.45
  Bottom 0.203: v42.71,25.78 43.37,26.44 43.37,32.36 v41.06,34.67
LCD_D/C  (via drill 0.41)
  Top 0.203: U2_DISP.122 45.75,13.53 v46.14,13.97 | v73.42,20.82 73.58,20.98 J2_UC.3
  Bottom 0.203: v46.14,13.97 46.14,12.33 46.91,11.56 46.91,5.85 48.08,4.67 56.08,4.67 72.22,20.82 v73.42,20.82
LCD_RD  (via drill 0.41)
  Top 0.203: U2_DISP.121 45.35,14.7 v45.38,14.73 | J2_UC.2 74.01,20.48 73.61,20.08 v72.71,20.08 v72.71,20.09
  Bottom 0.203: v45.38,14.73 45.35,14.71 45.35,12.61 46.55,11.42 46.55,5.27 47.5,4.32 56.22,4.32 71.99,20.09 v72.71,20.09
LCD_RST  (via drill 0.41)
  Top 0.203: U2_DISP.127 47.75,13.9 v47.79,13.97 | J2_UC.4 73.14,21.48 58.27,6.6 v56.64,6.6
  Bottom 0.203: v47.79,13.97 48.43,13.25 48.43,10.48 52.3,6.6 v56.64,6.6
LCD_TE  (via drill 0.41)
  Top 0.203: U2_DISP.50 41.35,27.01 40.81,26.46 v40.81,26.42 | v71.12,28.57 73.72,25.98 J2_UC.13
  Bottom 0.203: v40.81,26.42 40.81,25.53 41.31,25.02 45.44,25.02 51.79,31.37 68.33,31.37 v71.12,28.57
LCD_WR  (via drill 0.41)
  Top 0.203: U2_DISP.120 44.95,13.75 v44.62,13.97 | J2_UC.1 74.01,19.98 73.26,19.22 72.06,19.22 v72.05,19.21
  Bottom 0.203: v44.62,13.97 44.62,11.31 44.89,11.04 44.89,4.72 45.65,3.96 56.37,3.96 71.61,19.21 v72.05,19.21
N$4
  Top 0.203: U2_DISP.128 48.9,11.84 49.61,11.84 51.11,10.34 51.11,5.73 R5.1
N$9
  Top 0.203: U5_TCH-CTRL.9 C14.2 | C14.2
N$14
  Top 0.203: 54.39,40.07 R10.2 LD1.A
N$54
  Top 0.203: 59.65,23.32 U2_DISP.24 | Y2.2 59.65,25.15 59.65,23.32 | C8.2 63.59,23.32 59.65,23.32
N$55
  Top 0.203: C9.2 63.59,21.74 59.61,21.74 | R6.1 59.61,21.79 59.61,21.74 | 59.61,21.74 59.61,17.93 Y2.1
N$60
  Top 0.203: U2_DISP.22 52.99,22.52 R6.2
PIXEL_D0  (via drill 0.41)
  Top 0.203: U2_DISP.7 47.44,16.52 v47.03,16 | v71.12,27.56 73.2,25.48 J2_UC.12
  Bottom 0.203: v47.03,16 46.65,15.62 45.65,15.62 44.39,16.88 44.39,20.47 54.91,30.99 67.69,30.99 v71.12,27.56
PIXEL_D1  (via drill 0.41)
  Top 0.203: U2_DISP.8 46.57,16.92 v46.01,16.36 | v71.12,26.54 72.68,24.98 J2_UC.11
  Bottom 0.203: v46.01,16.36 45.54,16.36 44.87,17.03 44.87,20.45 55.03,30.61 67.06,30.61 v71.12,26.54
PIXEL_D2  (via drill 0.41)
  Top 0.203: U2_DISP.9 46.91,17.32 46.91,17.33 v45.55,17.33 | v71.12,25.53 72.17,24.48 J2_UC.10
  Bottom 0.203: v45.55,17.33 45.35,17.52 45.35,20.43 55.16,30.24 66.42,30.23 v71.12,25.53
PIXEL_D3  (via drill 0.41)
  Top 0.203: U2_DISP.10 46.68,17.72 v46.01,18.29 | v71.14,24.51 71.68,23.98 J2_UC.9
  Bottom 0.203: v46.01,18.29 v46.02,18.29 46.02,20.59 55.2,29.77 65.89,29.77 v71.14,24.51
PIXEL_D4  (via drill 0.41)
  Top 0.203: U2_DISP.11 47.58,18.12 v46.99,18.67 | v71.12,23.5 71.11,23.48 J2_UC.8
  Bottom 0.203: v46.99,18.67 46.99,18.71 46.75,18.95 46.75,20.82 54.32,28.39 66.24,28.32 71.05,23.52 v71.12,23.5
PIXEL_D5  (via drill 0.41)
  Top 0.203: U2_DISP.116 43.35,14.1 v43.73,14.48 | v74.09,22.14 74.93,22.98 J2_UC.7
  Bottom 0.203: v43.73,14.48 43.72,11.46 42.99,10.72 42.99,6.02 45.4,3.61 57.38,3.61 74.09,20.32 v74.09,22.14
PIXEL_D6  (via drill 0.41)
  Top 0.203: U2_DISP.115 42.95,15.29 v42.97,15.24 | v75.16,22.14 75.5,22.48 J2_UC.6
  Bottom 0.203: v42.97,15.24 42.95,11.19 42.64,10.87 42.64,5.81 45.19,3.25 57.53,3.25 75.16,20.88 v75.16,22.14
PIXEL_D7  (via drill 0.41)
  Top 0.203: U2_DISP.114 42.55,14.13 v42.2,14.48 | J2_UC.5 v79.95,21.98 v79.96,21.97
  Bottom 0.203: v42.2,14.48 42.17,5.72 45,2.9 57.67,2.9 76.75,21.97 v79.96,21.97
TS_CS
  Top 0.203: U5_TCH-CTRL.15 61.52,46.18 77.72,29.98 J2_UC.21
TS_DCLK
  Top 0.203: U5_TCH-CTRL.16 62.25,46.82 J2_UC.22
TS_DIN
  Top 0.203: U5_TCH-CTRL.14 60.89,45.54 76.95,29.48 J2_UC.20
TS_DOUT
  Top 0.203: U5_TCH-CTRL.12 61.03,44.26 76.3,28.98 J2_UC.19
TS_INT
  Top 0.203: U5_TCH-CTRL.11 41.22,43.62 R1.1 48.03,43.56 60.45,43.56 75.53,28.48 J2_UC.18
VDD  (via drill 0.41)
  Top 0.203: U2_DISP.84 33.26,18.92 33.16,18.82 33.16,17.76 32.4,17 30.24,17 XC24.2 29.09,18.16 v27.98,18.16 | U2_DISP.97 34.02,12.58 31.94,10.5 30.38,10.5 29.33,11.56 XC26.2 v27.98,11.56 | U2_DISP.66 34.25,26.12 32.77,26.12 32.48,25.83 30.19,25.83 XC22.2 28.85,27.18 v27.85,27.18 | U2_DISP.75 33.39,22.52 32.28,21.41 30.24,21.41 XC23.2 29.11,22.29 v27.79,22.29 | U2_DISP.95 33.36,14.52 32.04,13.21 32.04,12.73 31.89,12.58 30.38,12.58 29.38,13.59 XC25.2 v27.98,13.59 | U2_DISP.100 36.95,11.71 35.57,10.34 33.8,10.34 33.68,10.21 33.68,8.65 34.69,7.65 XC27.2 34.84,7.36 v34.84,6.22 | XC28.2 39.23,7.67 | 39.23,7.67 38.23,8.68 38.23,10.26 39.55,11.59 39.95,11.59 40.15,11.79 U2_DISP.108 | U2_DISP.117 43.75,11.29 42.65,10.19 42.65,8.68 43.65,7.67 XC29.2 43.86,7.33 v43.86,6.22 | U2_DISP.27 49.73,24.57 50.66,24.57 52.16,26.07 52.16,27.58 52.31,27.72 53.82,27.72 54.82,26.72 XC34.2 55.04,26.8 v56.17,26.8 | U2_DISP.34 47.75,28.98 48.41,29.65 48.41,32.01 49.42,33.02 XC35.2 v49.44,34.42 | U2_DISP.42 44.55,29.95 43.99,30.5 43.99,32.15 XC36.2 v45,34.42 | U2_DISP.48 42.16,28.85 41.16,29.85 40.23,29.85 39.75,30.33 | 39.59,33.16 XC38.2 38.55,33.81 v39.16,34.42 39.61,34.42 40.58,33.45 XC37.2 40.47,33.05 40.36,33.16 39.59,33.16 | 39.59,33.16 39.57,33.14 39.57,30.5 39.75,30.33 | U2_DISP.58 38.16,28.85 37.93,29.07 36.92,29.07 35.71,30.29 33.69,30.29 33.48,30.5 33.48,32.15 XC39.2 v34.46,34.42 | J1_DISP.37 5.78,31.01 5.78,29.24 5.25,28.7 v5.25,27.99 | 18.2,9 C6.2 | v39.41,6.22 39.41,7.5 39.23,7.67 | U2_DISP.54 39.75,30.33 | R5.2 54.57,5.46 v55.88,5.46 | U2_DISP.16 50.53,20.12 52.11,18.55 52.11,17.08 53.49,15.7 XC33.2 54.74,14.68 v56.9,14.68
  Top 0.203: U2_DISP.12 50.54,18.52 51.04,18.02 51.04,16.64 52.11,15.57 52.11,14.55 53.04,13.61 55.46,13.61 57.34,11.74 XC32.2 v58.42,10.42 v58.42,10.41 | U2_DISP.4 50.85,15.32 51.04,15.13 51.04,12.53 52.71,10.86 54.34,10.86 XC31.2 v56.59,9.83 | U2_DISP.124 46.55,11.43 47.72,10.26 XC30.2 47.72,9.2 46.69,8.18 46.69,6.68 47.16,6.2 v47.66,6.2 | v51.4,38.57 R10.1 | U5_TCH-CTRL.10 38.63,42.98 34.79,46.82 U5_TCH-CTRL.1 32.14,46.82 XC40.2 v31.8,48.64 | J2_UC.14 79.84,26.48 v80.03,26.29 | R1.2 47.62,40.31 v49.12,40.31
  Top 1.016: U3_LDO.2 19.98,7.22 18.2,9 | 17.78,8.92 17.78,5.14 | 17.78,8.92 C6.2 | 17.78,8.92 8.78,8.92 5.25,12.45 5.26,12.46 v5.26,24.94 5.25,24.95 5.26,24.96 v5.26,25.96 5.26,26.96 v5.24,26.97 v5.25,26.98 v5.25,27.99 | v80.03,26.29 v80.03,23.24
  VCC 0.203: 34.46,35.56 34.29,35.56
  VCC 0.406: v43.86,6.22 43.86,2.86 | v27.98,11.56 26.01,11.56 | 25.96,13.59 v27.98,13.59 | v27.98,18.16 25.78,18.16 | v27.79,22.29 25.66,22.29 | v27.85,27.18 27.85,26.07 25.74,23.96 | v49.44,34.42 49.44,35.77 | v45,34.42 46.39,35.81 | v39.16,34.42 39.16,35.77 | v34.46,34.42 34.46,35.56 34.46,35.73 | 56.43,4.36 56.39,4.32 | v34.84,6.22 34.84,4.49 | v39.41,6.22 39.41,4.23 | v56.17,26.8 58.04,26.8 | v55.88,5.46 55.88,4.32 | v56.59,9.83 57.61,9.83 | v56.9,14.68 57.71,14.68 | v47.66,6.2 47.66,4.33
  VCC 1.524: 28.33,2.79 26,5.12
  other vias: 17.78,7.49 17.78,6.48 17.78,5.46 80.06,25.27 80.06,24.26
  pour VCC: 39.62,2.67 27.81,2.67 27.69,2.54 27.69,2.41
  pour VCC: 58.04,0.5 29.46,0.5 26.54,5.08 26.54,5.21 58.04,5.21
  pour VCC: 26.39,7.34 26.39,30.48 4.32,30.48 4.32,0.5 26.16,0.5 33.02,0.71
  pour VCC: 57.15,1.27 85.09,1.27 85.09,49.53 30.48,49.53 30.48,36.83 31.75,35.56 52.07,35.56 57.15,30.48
VDD(16V)
  Top 0.203: J1_DISP.39 4.76,30.07 4.05,29.36 4.05,27.96 | J2_UC.16 80.44,27.48 81.3,26.62
  Top 1.016: 4.05,27.96 4.05,9.74 10.23,3.56 64.34,3.56 81.3,20.52 81.3,26.62
VDDD  (via drill 0.41)
  Top 0.152: U2_DISP.32 51.22,28.05 53.86,28.05 54.89,29.08
  Top 0.203: U2_DISP.64 35.75,28.77 32.96,28.77 31.85,29.87 30.33,29.87 29.33,28.87 XC5.2 29.02,28.7 v27.85,28.7 | U2_DISP.73 33.28,23.32 33.16,23.43 33.16,24.41 32.12,25.45 30.38,25.45 29.38,24.45 XC6.2 29.24,24.38 v27.85,24.38 | U2_DISP.93 33.42,15.32 32.11,16.62 30.38,16.62 29.38,15.62 XC8.2 v27.98,15.62 | U2_DISP.82 33.22,19.72 31.89,21.04 30.24,21.04 XC7.2 29.09,20.19 v27.85,20.19 | U2_DISP.102 37.75,8.46 36.87,7.58 | XC9.2 36.87,7.66 36.87,7.58 | U2_DISP.110 40.95,11.72 42.27,10.4 42.27,8.68 41.26,7.67 XC10.2 41.31,7.48 v41.31,6.22 | U2_DISP.119 44.55,11.17 45.38,10.34 46.54,10.34 46.69,10.19 46.69,8.68 45.68,7.67 XC11.2 45.76,7.46 v45.76,6.22 | U2_DISP.25 50.56,23.72 50.61,23.68 53.95,23.68 XC16.2 55.04,24.76 v56.17,24.76 | U2_DISP.40 45.35,28.86 45.55,29.05 46.58,29.05 48.03,30.5 48.03,32.15 XC20.2 v47.03,34.42 | U2_DISP.46 42.95,28.89 43.61,29.55 43.61,32.15 XC18.2 v42.58,34.42 | U2_DISP.56 38.95,29.09 37.54,30.5 37.54,32.13 XC19.2 v36.49,34.42 | v36.87,6.22 36.87,7.58 | v56.17,29.08 XC21.2 54.89,29.08 | v32.54,8.79 32.51,8.81 | v56.84,19.76 XC17.2 54.59,20.79 52.97,20.79 52.82,20.94 52.82,21.29 51.98,22.12 U2_DISP.21 | U2_DISP.18 50.99,20.92 v51.12,21.01 51.12,20.6 53.72,18 C7.2 | U2_DISP.14 50.78,19.32 51.75,18.35 51.75,16.93 52.82,15.86 52.82,14.84 53.34,14.33 55.83,14.33 56.5,13.67 v56.9,13.67 58.32,13.67 XC15.2 | U2_DISP.6 51.06,16.12 51.75,15.42 51.75,14.4 52.9,13.26 53.97,13.26 XC14.2 55.75,11.48 v56.59,11.48 | U2_DISP.1 49.69,12.26 51.46,10.48 51.46,8.79 v51.82,8.43 52.45,7.8 XC13.2 | U2_DISP.126 47.37,12.56 47.37,11.77 47.55,11.59 48.47,11.59 v49.15,10.91 v49.15,10.9 49.75,10.3 XC12.2
  Top 1.016: C5.2 23.89,7.22 U3_LDO.1
  Top 1.524: C5.2 26.19,8.81 v28.85,8.79 v30.12,8.79 v31.39,8.79 32.51,8.81
  VCC 0.406: v45.76,6.22 45.76,8.64 45.89,8.76 | v41.31,6.22 41.31,8.44 41.63,8.76 | v36.87,6.22 36.87,8.57 37.06,8.76 37.09,8.79 | v27.85,20.19 29.95,20.19 30.14,20 | v27.85,24.38 30.01,24.38 30.14,24.51 | v27.85,28.7 29.95,28.7 30.14,28.89 | v36.49,34.42 36.49,32.26 | v42.58,34.42 42.58,32.39 42.46,32.26 | v47.03,34.42 47.03,32.32 47.09,32.26 | v56.17,29.08 54.4,29.08 54.33,29.15 | v27.98,15.62 30.01,15.62 30.14,15.49 | v56.17,24.76 54.54,24.76 54.33,24.97 | v51.12,21.01 51.12,20.53 52.38,19.28 54.33,19.28 54.82,19.76 v56.84,19.76 | 54.33,13.64 56.87,13.64 v56.9,13.67 | 54.33,11.53 56.54,11.53 v56.59,11.48 | v51.82,8.43 52.15,8.76 52.86,8.76 | v49.15,10.9 49.15,9.27 49.66,8.76
  VCC 1.524: 30.14,9.4 30.75,8.79
  VCC 2.032: 37.06,8.76 41.63,8.76 45.89,8.76 49.66,8.76 52.86,8.76 54.33,10.24 54.33,11.53 54.33,13.64 54.33,19.28 | 37.09,8.79 v32.54,8.79 30.75,8.79 v27.71,8.79 | 54.33,24.97 54.33,29.15 | 54.4,29.08 51.22,32.26 47.09,32.26 42.46,32.26 36.49,32.26 33.5,32.26 30.14,28.89 30.14,24.51 30.14,20 30.14,15.49 30.14,9.4
XL
  Top 0.203: J1_DISP.2 23.26,31.8 23.66,32.21 26.17,32.21 35.49,41.52 35.49,44.23 34.82,44.9 U5_TCH-CTRL.4
XR
  Top 0.203: J1_DISP.4 22.26,33.97 24.31,36.03 28.68,36.03 30.52,37.87 30.52,45.73 30.97,46.18 U5_TCH-CTRL.2
YD
  Top 0.203: J1_DISP.3 22.76,33.97 24.46,35.67 28.88,35.67 35.12,41.92 35.12,44.02 34.88,44.26 U5_TCH-CTRL.5
YU
  Top 0.203: J1_DISP.1 25.5,31.04 35.94,41.48 35.94,44.4 34.8,45.54 U5_TCH-CTRL.3